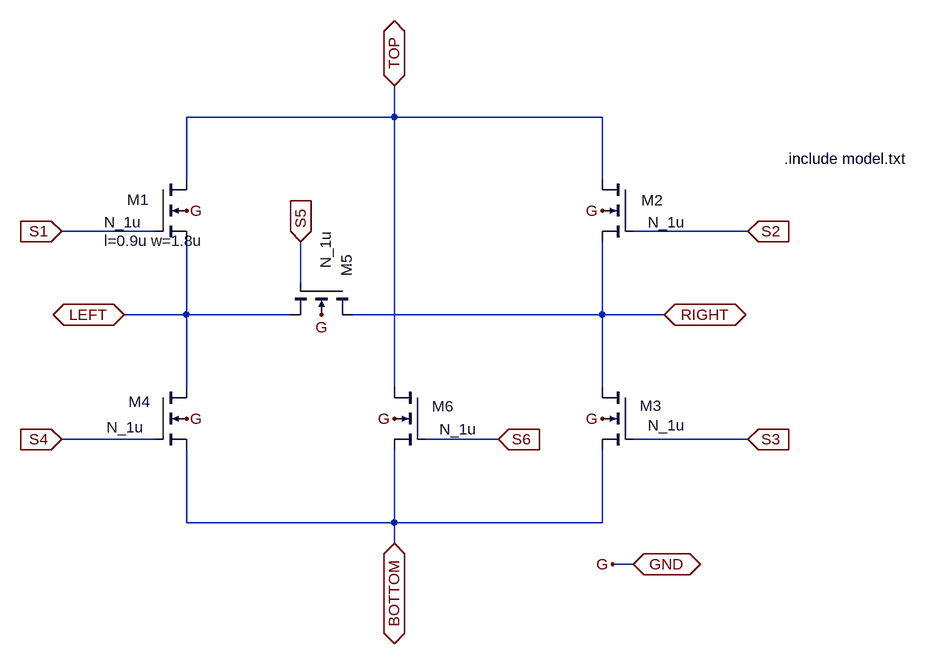
[diagram p0: schematic switch_mat_new.asc]
switch_mat_new.asc, the LTspice schematic file:
Version 4
SHEET 1 1664 832
WIRE 224 -64 224 -112
WIRE 224 -64 -96 -64
WIRE 544 -64 224 -64
WIRE -96 32 -96 -64
WIRE 544 32 544 -64
WIRE -144 112 -288 112
WIRE 768 112 592 112
WIRE 80 192 80 128
WIRE -96 240 -96 128
WIRE -96 240 -192 240
WIRE 64 240 -96 240
WIRE 544 240 544 128
WIRE 544 240 160 240
WIRE 640 240 544 240
WIRE -96 352 -96 240
WIRE 224 352 224 -64
WIRE 544 352 544 240
WIRE -144 432 -288 432
WIRE 384 432 272 432
WIRE 768 432 592 432
WIRE -96 560 -96 448
WIRE 224 560 224 448
WIRE 224 560 -96 560
WIRE 544 560 544 448
WIRE 544 560 224 560
WIRE 224 592 224 560
WIRE 592 624 560 624
FLAG -288 112 S1
IOPIN -288 112 In
FLAG -288 432 S4
IOPIN -288 432 In
FLAG 768 112 S2
IOPIN 768 112 In
FLAG 768 432 S3
IOPIN 768 432 In
FLAG 384 432 S6
IOPIN 384 432 In
FLAG 80 128 S5
IOPIN 80 128 In
FLAG 592 624 GND
IOPIN 592 624 BiDir
FLAG 640 240 RIGHT
IOPIN 640 240 BiDir
FLAG -192 240 LEFT
IOPIN -192 240 BiDir
FLAG 224 -112 TOP
IOPIN 224 -112 BiDir
FLAG 224 592 BOTTOM
IOPIN 224 592 BiDir
FLAG 560 624 G
FLAG 224 400 G
FLAG -96 400 G
FLAG -96 80 G
FLAG 112 240 G
FLAG 544 80 G
FLAG 544 400 G
SYMBOL nmos4 -144 32 R0
WINDOW 0 -43 31 Left 2
WINDOW 3 -79 66 Left 2
WINDOW 123 -79 94 Left 2
SYMATTR InstName M1
SYMATTR Value N_1u
SYMATTR Value2 l=0.9u w=1.8u
SYMBOL nmos4 592 32 M0
WINDOW 0 -46 32 Left 2
WINDOW 3 -80 66 Left 2
SYMATTR InstName M2
SYMATTR Value N_1u
SYMATTR Value2 l=0.9u w=1.8u
SYMBOL nmos4 592 352 M0
WINDOW 0 -44 28 Left 2
WINDOW 3 -80 58 Left 2
SYMATTR InstName M3
SYMATTR Value N_1u
SYMATTR Value2 l=0.9u w=1.8u
SYMBOL nmos4 -144 352 R0
WINDOW 0 -41 22 Left 2
WINDOW 3 -75 61 Left 2
SYMATTR InstName M4
SYMATTR Value N_1u
SYMATTR Value2 l=0.9u w=1.8u
SYMBOL nmos4 160 192 R90
WINDOW 0 -44 9 Left 2
WINDOW 3 -81 42 Left 2
SYMATTR InstName M5
SYMATTR Value N_1u
SYMATTR Value2 l=0.9u w=1.8u
SYMBOL nmos4 272 352 M0
WINDOW 0 -44 29 Left 2
WINDOW 3 -79 64 Left 2
SYMATTR InstName M6
SYMATTR Value N_1u
SYMATTR Value2 l=0.9u w=1.8u
TEXT 824 0 Left 2 !.include model.txt

The netlist it stands for:
* switch_mat_new.asc
M1 TOP S1 LEFT G N_1u l=0.9u w=1.8u
M2 TOP S2 RIGHT G N_1u l=0.9u w=1.8u
M3 RIGHT S3 BOTTOM G N_1u l=0.9u w=1.8u
M4 LEFT S4 BOTTOM G N_1u l=0.9u w=1.8u
M5 RIGHT S5 LEFT G N_1u l=0.9u w=1.8u
M6 TOP S6 BOTTOM G N_1u l=0.9u w=1.8u
.model NMOS NMOS
.model PMOS PMOS
.lib standard.mos
.include model.txt
.backanno
.end